# EAGLE schematic 555_timers_x2 (EAGLE 5.07)
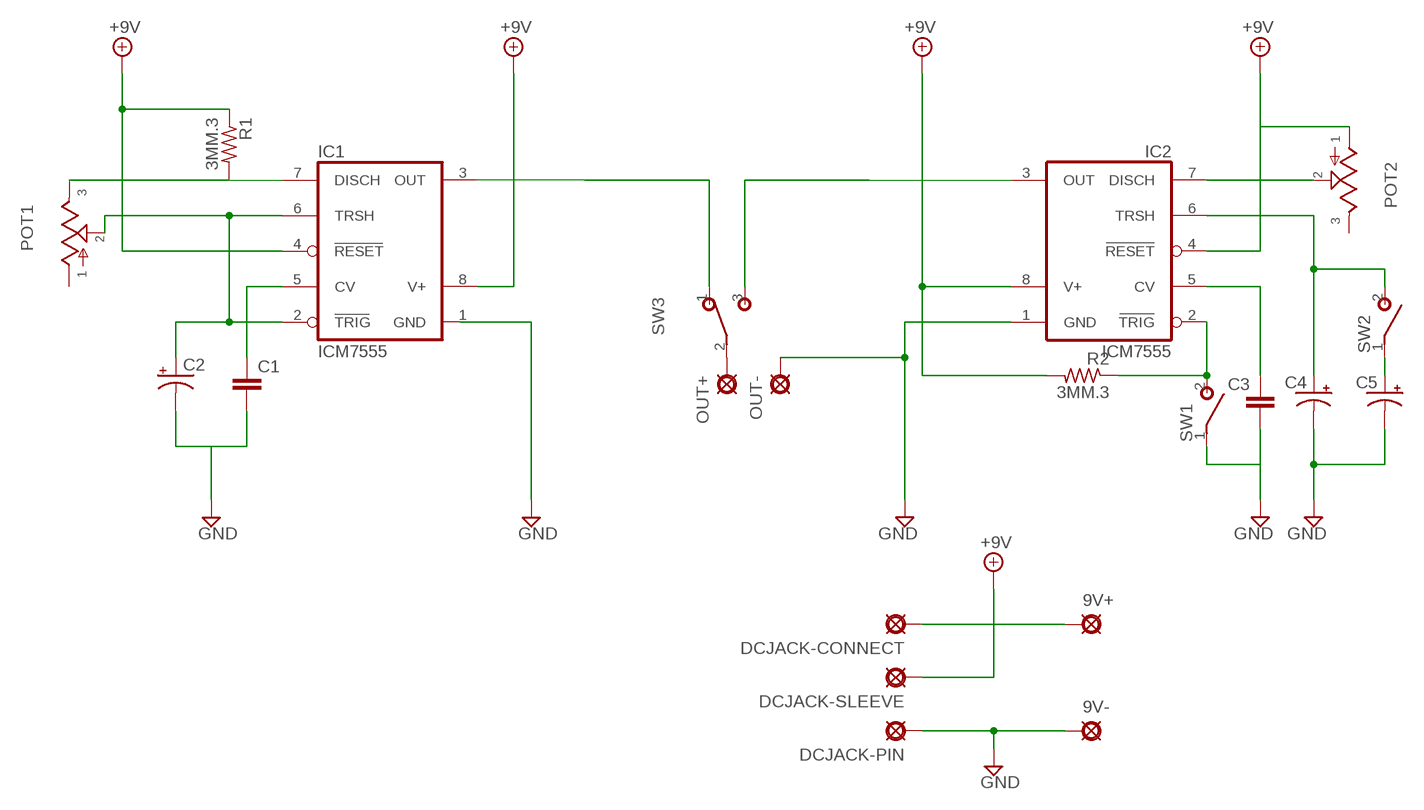
[diagram p0: schematic, sheet 1]

## Parts
9V+  PAD  [SQUARE]
9V-  PAD8  [OCTOGON]
C1  050X030_0251  [050X030_025]
C2  0501  [050_020_1]
C3  050X030_0251  [050X030_025]
C4  0501  [050_020_1]
C5  0501  [050_020_1]
DCJACK-CONNECT  PAD  [SQUARE]
DCJACK-PIN  PAD8  [OCTOGON]
DCJACK-SLEEVE  PAD  [SQUARE]
IC1  ICM7555  [DIL08]
IC2  ICM7555  [DIL08]
OUT+  PAD  [SQUARE]
OUT-  PAD8  [OCTOGON]
POT1  POT  [POT]
POT2  POT  [POT]
R1  3MM.3  [R0204/3]
R2  3MM.3  [R0204/3]
SW1  SPST  [SPST]
SW2  SPST  [SPST]
SW3  SPDTPADS  [SPDT]

## Nets
+9V: DCJACK-SLEEVE.1(PAD) IC1.4(RESET) IC1.8(V+) IC2.4(RESET) IC2.8(V+) POT2.1 R1.1 R2.2
GND: 9V-.1(PAD) C1.2 C2.- C3.2 C4.- C5.- DCJACK-PIN.1(PAD) IC2.1(GND) OUT-.1(PAD) SW1.1(P)
N$1: IC1.3(OUT) SW3.1(O)
N$2: OUT+.1(PAD) SW3.2(P)
N$3: C1.1 IC1.5(CV)
N$4: C2.+ IC1.2(TRIG) IC1.6(TRSH) POT1.2
N$6: 9V+.1(PAD) DCJACK-CONNECT.1(PAD)
N$7: IC1.7(DISCH) POT1.3 R1.2
N$8: IC2.3(OUT) SW3.3(S)
N$9: C3.1 IC2.5(CV)
N$10: IC2.2(TRIG) R2.1 SW1.2(S)
N$12: IC2.7(DISCH) POT2.2
N$13: C4.+ IC2.6(TRSH) SW2.2(S)
N$14: C5.+ SW2.1(P)
Unconnected: POT1.1 POT2.3

## Power pins joined to a net without a drawn wire
GND: IC1.1(GND)

## Library data of the parts
9V+ 9V- DCJACK-CONNECT DCJACK-PIN DCJACK-SLEEVE OUT+ OUT- = gm-supply:PAD: PAD use this package for pads with any purpose, including input, output, send or return various pad shapes: round, square, octogonal, long, and long offset
C1 C3 = gm-caps-ceramic:050X030_025: 47 - 120pF Xicon Ceramic Disc 2.5mm lead spacing
C2 C4 C5 = gm-caps-electro-pol:050: 0.22 - 100uF Xicon values at Mouser.com: 10V: 10 - 100uF; 16V: 2.2 - 47uF; 25V: 0.47 - 47uF; 50V: 0.22 - 22uF
IC1 IC2 = maxim:ICM7555: TIMER
POT1 POT2 = gm-pots:POT: Potentiometers the arrow indicates the clockwise motion of th wiper (lug 2) fully counter clockwise there is no resistance between lugs 1 and 2 fully clockwise the resistance between lugs 1 and 2 is the value of the pot
R1 R2 = gm-resistors:3MM: 3mm Resistors Leads spaced 1-6 holes apart for 0.1" perfboard. Suitable for 1/8 watt resistors.
SW1 SW2 = gm-switches:SPST
SW3 = gm-switches:SPDT: TOGGLE SWITCH Marquardt